# EAGLE design Business Card (EAGLE 6.4)
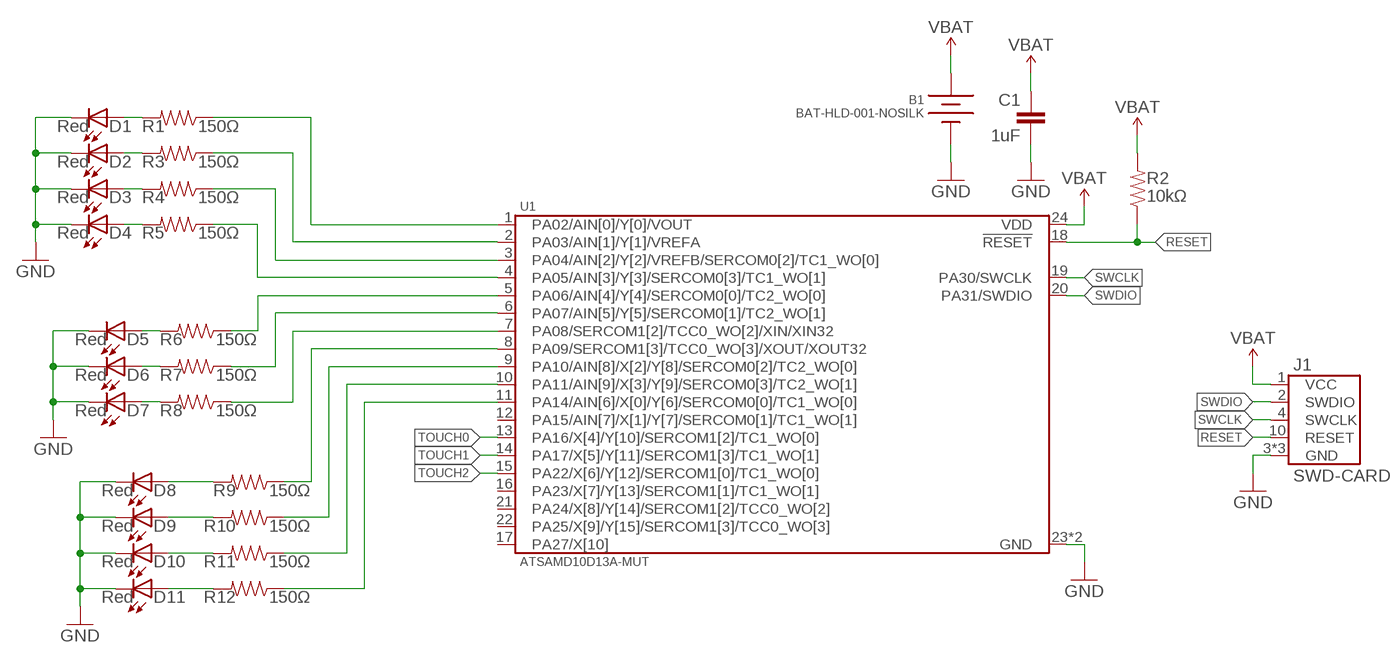
[diagram p0: schematic, sheet 1]

## Parts
B1  BAT-HLD-001-NOSILK  [BK-912-G-TR]
C1  1uF  CAP-0603  [0603-CAP]
D1  Red  LED-0805  [0805-LED]
D2  Red  LED-0805  [0805-LED]
D3  Red  LED-0805  [0805-LED]
D4  Red  LED-0805  [0805-LED]
D5  Red  LED-0805  [0805-LED]
D6  Red  LED-0805  [0805-LED]
D7  Red  LED-0805  [0805-LED]
D8  Red  LED-0805  [0805-LED]
D9  Red  LED-0805  [0805-LED]
D10  Red  LED-0805  [0805-LED]
D11  Red  LED-0805  [0805-LED]
J1  SWD-CARD  [CWR-170-10-0203]
R1  150Ω  RESISTOR-0603  [0603-CAP]
R2  10kΩ  RESISTOR-0603  [0603-CAP]
R3  150Ω  RESISTOR-0603  [0603-CAP]
R4  150Ω  RESISTOR-0603  [0603-CAP]
R5  150Ω  RESISTOR-0603  [0603-CAP]
R6  150Ω  RESISTOR-0603  [0603-CAP]
R7  150Ω  RESISTOR-0603  [0603-CAP]
R8  150Ω  RESISTOR-0603  [0603-CAP]
R9  150Ω  RESISTOR-0603  [0603-CAP]
R10  150Ω  RESISTOR-0603  [0603-CAP]
R11  150Ω  RESISTOR-0603  [0603-CAP]
R12  150Ω  RESISTOR-0603  [0603-CAP]
U1  ATSAMD10D13A-MUT  [QFN-24]

## Nets
GND: B1.-(N) C1.2 D1.C D2.C D3.C D4.C D5.C D6.C D7.C D8.C D9.C D10.C D11.C J1.3(GND) J1.5(GND) J1.9(GND) U1.23(GND) U1.P$1(GND)
N$4: D1.A R1.2
N$5: D5.A R6.2
N$6: D2.A R3.2
N$7: D6.A R7.2
N$8: D3.A R4.2
N$9: D7.A R8.2
N$10: D4.A R5.2
N$11: D8.A R9.2
N$12: D9.A R10.2
N$13: D10.A R11.2
N$14: D11.A R12.2
N$15: R5.1 U1.4(PA05/AIN[3]/Y[3]/SERCOM0[3]/TC1_WO[1])
N$16: R4.1 U1.3(PA04/AIN[2]/Y[2]/VREFB/SERCOM0[2]/TC1_WO[0])
N$17: R3.1 U1.2(PA03/AIN[1]/Y[1]/VREFA)
N$18: R1.1 U1.1(PA02/AIN[0]/Y[0]/VOUT)
N$19: R6.1 U1.5(PA06/AIN[4]/Y[4]/SERCOM0[0]/TC2_WO[0])
N$20: R7.1 U1.6(PA07/AIN[5]/Y[5]/SERCOM0[1]/TC2_WO[1])
N$21: R8.1 U1.7(PA08/SERCOM1[2]/TCC0_WO[2]/XIN/XIN32)
N$22: R9.1 U1.8(PA09/SERCOM1[3]/TCC0_WO[3]/XOUT/XOUT32)
N$23: R10.1 U1.9(PA10/AIN[8]/X[2]/Y[8]/SERCOM0[2]/TC2_WO[0])
N$24: R11.1 U1.10(PA11/AIN[9]/X[3]/Y[9]/SERCOM0[3]/TC2_WO[1])
N$25: R12.1 U1.11(PA14/AIN[6]/X[0]/Y[6]/SERCOM0[0]/TC1_WO[0])
RESET: J1.10(RESET) R2.1 U1.18(!RESET)
SWCLK: J1.4(SWCLK) U1.19(PA30/SWCLK)
SWDIO: J1.2(SWDIO) U1.20(PA31/SWDIO)
TOUCH0: U1.13(PA16/X[4]/Y[10]/SERCOM1[2]/TC1_WO[0])
TOUCH1: U1.14(PA17/X[5]/Y[11]/SERCOM1[3]/TC1_WO[1])
TOUCH2: U1.15(PA22/X[6]/Y[12]/SERCOM1[0]/TC1_WO[0])
VBAT: B1.+1(P) B1.+2(P) C1.1 J1.1(VCC) R2.2 U1.24(VDD)
Unconnected: U1.12(PA15/AIN[7]/X[1]/Y[7]/SERCOM0[1]/TC1_WO[1]) U1.16(PA23/X[7]/Y[13]/SERCOM1[1]/TC1_WO[1]) U1.17(PA27/X[10]) U1.21(PA24/X[8]/Y[14]/SERCOM1[2]/TCC0_WO[2]) U1.22(PA25/X[9]/Y[15]/SERCOM1[3]/TCC0_WO[3])

## Library data of the parts
B1 = Connectors:BAT-HLD-001
C1 = Passives:CAP
D1-D11 = Passives:LED
J1 = Connectors:SWD
R1-R12 = Passives:RESISTOR
U1 = Atmel:ATSAMD10D

## Board
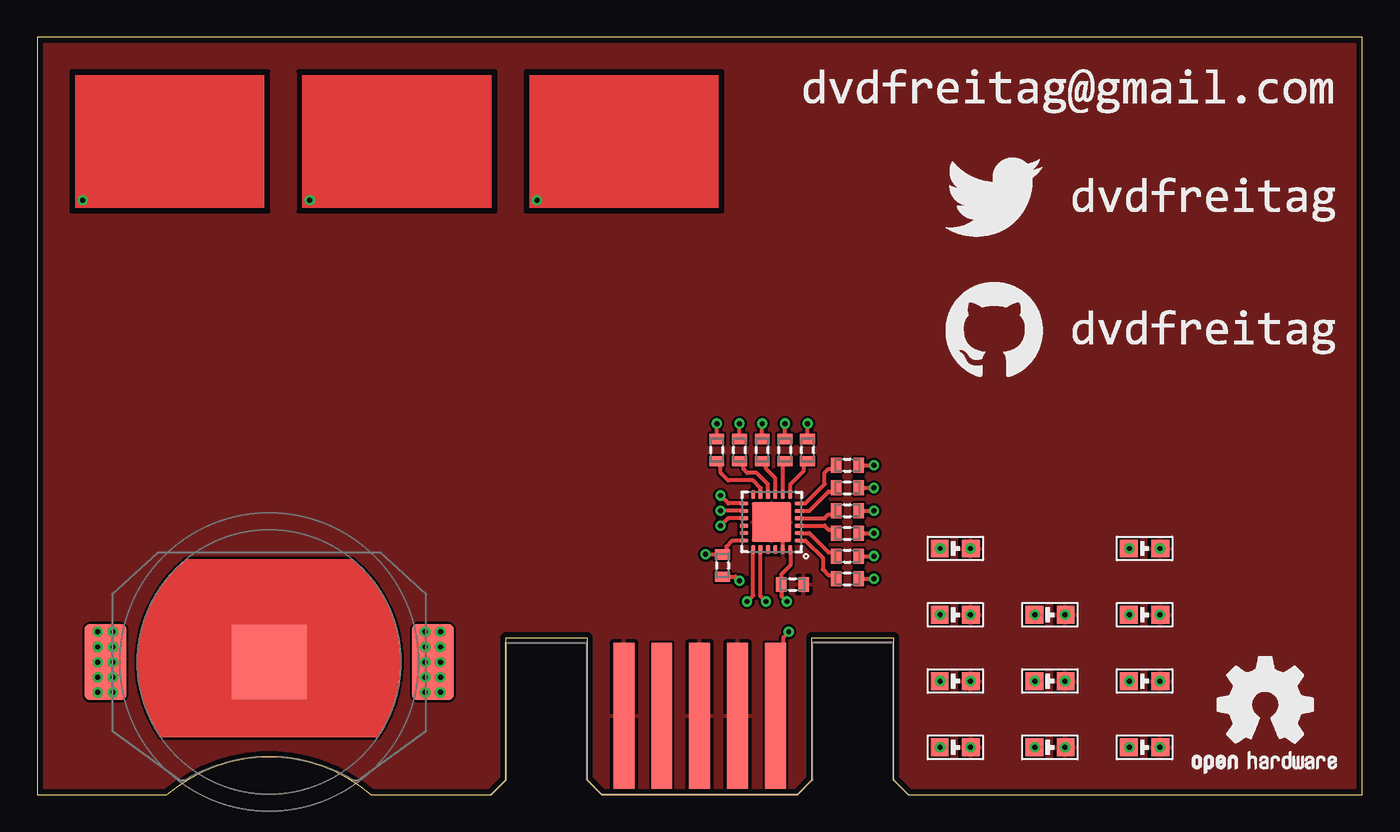
[diagram p1: board, top side]
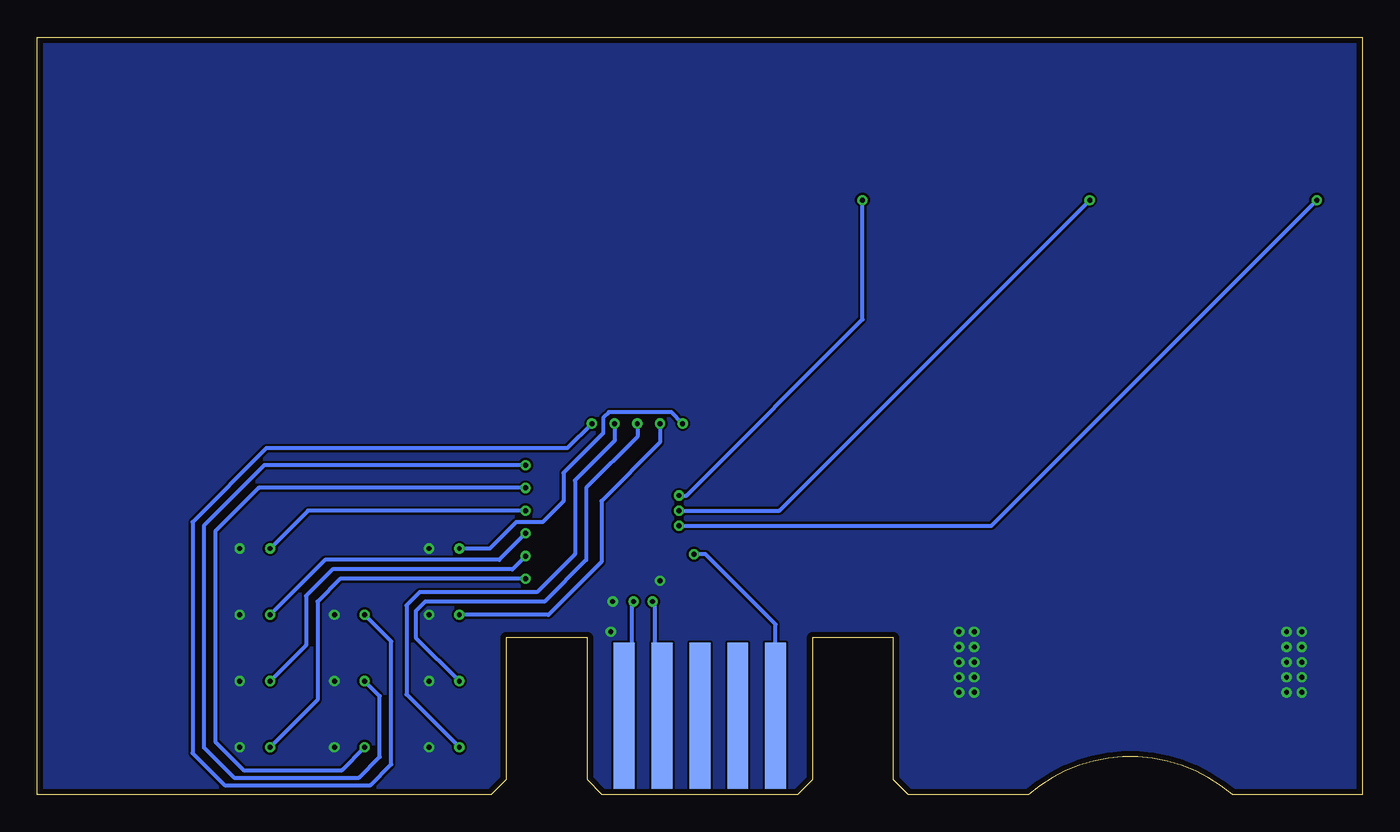
[diagram p2: board, bottom side, seen from below]

Size 88.9 x 50.8 mm. Coordinates in mm from the lower left corner, seen from the top.
Outline: 0,0 8.7,0 arc-81 22.42,0 30.45,0 31.45,1 31.45,10.52 36.9,10.52 36.9,1 37.9,0 50.99,0 51.99,1 51.99,10.52 57.45,10.52 57.45,1 58.45,0 88.9,0 88.9,50.8 0,50.8 0,0
Copper layers (1*16): Top 0.0356mm / dielectric 1.5011mm / Bottom 0.0356mm
Design rules "oshpark-2layer *": minimum track width 6mil, minimum drill 13mil, track to track 6mil, track to pad 6mil, pad to pad 6mil, via to via 6mil, smd to smd 6mil, copper to edge 15mil, drill to drill 6mil, minimum pad ring 7mil, minimum via ring 7mil, stop-mask expansion 4mil, vias tented up to drill 20mil, thermal gap 10mil
tRestrict: 12 lines

### Footprints (pad centres in the part's own frame; a part is rotated, then mirrored left to right if it is on the bottom)
BK-912-G-TR = smd 2.79 x 5.08: +1 -10.985,0; +2 10.985,0 | smd 5 x 5: - 0,0
0603-CAP = smd 0.7 x 1: 1 -0.75,0; 2 0.75,0
0805-LED = smd 1.2 x 1.2: A -1.05,0; C 1.05,0
CWR-170-10-0203 = smd 1.4 x 9.8: 1 -5.08,-5.3; 3 -2.54,-5.3; 5 0,-5.3; 7 2.54,-5.3; 9 5.08,-5.3 | smd 1.4 x 9.8 bottom: 2 -5.08,-5.3; 4 -2.54,-5.3; 6 0,-5.3; 8 2.54,-5.3; 10 5.08,-5.3
QFN-24 = smd 0.6 x 0.29: 1 -1.85,1.25; 2 -1.85,0.75; 3 -1.85,0.25; 4 -1.85,-0.25; 5 -1.85,-0.75; 6 -1.85,-1.25; 13 1.85,-1.25; 14 1.85,-0.75; 15 1.85,-0.25; 16 1.85,0.25; 17 1.85,0.75; 18 1.85,1.25 | smd 0.29 x 0.6: 7 -1.25,-1.85; 8 -0.75,-1.85; 9 -0.25,-1.85; 10 0.25,-1.85; 11 0.75,-1.85; 12 1.25,-1.85; 19 1.25,1.85; 20 0.75,1.85; 21 0.25,1.85; 22 -0.25,1.85; 23 -0.75,1.85; 24 -1.25,1.85 | smd 2.65 x 2.65: P$1 0,0

### Placement (x,y rotation side)
B1  15.56,8.89 0 top
C1  50.67,14.1 0 top
D1  74.3,3.17 0 top
D2  74.3,7.62 0 top
D3  74.3,12.06 0 top
D4  74.3,16.51 0 top
D5  67.94,3.17 0 top
D6  67.94,7.62 0 top
D7  67.94,12.06 0 top
D8  61.59,3.17 0 top
D9  61.59,7.62 0 top
D10  61.59,12.06 0 top
D11  61.59,16.51 0 top
J1  44.45,0 180 top
R1  54.36,14.48 0 top
R2  45.97,15.37 270 top
R3  54.36,16 0 top
R4  54.36,17.53 0 top
R5  54.36,19.05 0 top
R6  54.36,20.57 0 top
R7  54.36,22.1 0 top
R8  51.69,23.11 90 top
R9  50.16,23.11 90 top
R10  48.64,23.11 90 top
R11  47.12,23.11 90 top
R12  45.59,23.11 90 top
U1  49.28,18.29 180 top
U$1  [GITHUB]  60.96,27.94 0 top
U$2  [TWITTER]  60.96,36.83 0 top
U$3  [OSHW]  77.47,1.27 0 top
U$4  [EMAIL]  51.44,45.72 0 top

### Tracks (layer width: path | path; a pad name or v marks a point on that pad's centre or on a via)
GND
  Top 0.254: U1.23 50.03,17.54 U1.P$1
  pour Top (rank 2): -1.27,52.07 90.17,52.07 90.17,-1.27 -1.27,-1.27
N$4  (via drill 0.33)
  Top 0.254: D1.A v73.28,3.17 | R1.2 v56.13,14.48
  Bottom 0.254: v56.13,14.48 68.58,14.48 70.1,12.95 70.1,6.35 v73.28,3.17
N$5  (via drill 0.33)
  Top 0.254: D5.A v66.93,3.17 | R6.2 v56.13,20.57
  Bottom 0.254: v56.13,20.57 74.04,20.57 76.96,17.65 76.96,3.56 75.06,1.65 68.45,1.65 v66.93,3.17
N$6  (via drill 0.33)
  Top 0.254: D2.A v73.28,7.62 | R3.2 v56.13,16
  Bottom 0.254: v56.13,16 57.02,15.11 69.09,15.11 70.87,13.34 70.87,10.03 v73.28,7.62
N$7  (via drill 0.33)
  Top 0.254: D6.A v66.93,7.62 | R7.2 v56.13,22.1
  Bottom 0.254: v56.13,22.1 73.66,22.1 77.72,18.03 77.72,3.17 75.69,1.14 67.31,1.14 65.91,2.54 65.91,6.6 v66.93,7.62
N$8  (via drill 0.33)
  Top 0.254: D3.A v73.28,12.06 | R4.2 v56.13,17.53
  Bottom 0.254: v56.13,17.53 57.91,15.75 69.6,15.75 v73.28,12.06
N$9  (via drill 0.33)
  Top 0.254: D7.A v66.93,12.06 | R8.2 v51.69,24.89
  Bottom 0.254: v51.69,24.89 53.34,23.24 73.53,23.24 78.49,18.29 78.49,2.79 76.33,0.64 66.55,0.64 65.15,2.03 65.15,10.29 v66.93,12.06
N$10  (via drill 0.33)
  Top 0.254: D4.A v73.28,16.51 | R5.2 v56.13,19.05
  Bottom 0.254: v56.13,19.05 70.74,19.05 v73.28,16.51
N$11  (via drill 0.33)
  Top 0.254: D8.A v60.58,3.17 | R9.2 v50.16,24.89
  Bottom 0.254: v50.16,24.89 50.16,23.75 52.83,21.08 52.83,16.13 55.37,13.59 63.25,13.59 64.14,12.7 64.14,6.73 v60.58,3.17
N$12  (via drill 0.33)
  Top 0.254: D9.A v60.58,7.62 | R10.2 v48.64,24.89
  Bottom 0.254: v48.64,24.89 48.64,24 52.07,20.57 52.07,15.75 54.86,12.95 62.87,12.95 63.5,12.32 63.5,10.54 v60.58,7.62
N$13  (via drill 0.33)
  Top 0.254: D10.A v60.58,12.06 | R11.2 v47.12,24.89
  Bottom 0.254: v47.12,24.89 47.12,23.62 51.05,19.68 51.05,15.62 54.61,12.06 v60.58,12.06
N$14  (via drill 0.33)
  Top 0.254: D11.A v60.58,16.51 | R12.2 v45.59,24.89
  Bottom 0.254: v45.59,24.89 46.35,25.65 50.55,25.65 50.93,25.27 50.93,24.26 53.59,21.59 53.59,19.68 54.99,18.29 56.77,18.29 58.55,16.51 v60.58,16.51
N$15
  Top 0.254: U1.4 52.83,18.54 53.09,18.8 53.35,18.8 R5.1
N$16
  Top 0.254: U1.3 52.83,18.04 53.09,17.78 53.35,17.78 R4.1
N$17
  Top 0.254: U1.2 51.8,17.54 53.09,16.26 53.35,16.26 R3.1
N$18
  Top 0.254: U1.1 51.54,17.04 52.7,15.88 52.7,15.11 53.09,14.73 53.35,14.73 R1.1
N$19
  Top 0.254: U1.5 51.8,19.04 53.09,20.32 53.35,20.32 R6.1
N$20
  Top 0.254: U1.6 51.54,19.54 52.83,20.83 52.83,21.59 53.09,21.84 53.35,21.84 R7.1
N$21
  Top 0.254: U1.7 50.53,20.81 51.44,21.72 51.44,22.11 R8.1
N$22
  Top 0.254: U1.8 50.03,22.21 R9.1
N$23
  Top 0.254: U1.9 49.53,21.21 48.9,21.84 48.9,22.11 R10.1
N$24
  Top 0.254: U1.10 49.03,20.82 48.26,21.59 47.62,21.59 47.37,21.84 47.37,22.11 R11.1
N$25
  Top 0.254: U1.11 48.53,20.56 48.01,21.08 46.35,21.08 45.85,21.59 45.85,22.11 R12.1
RESET  (via drill 0.33)
  Top 0.254: 45.99,16.13 R2.1 | v44.83,16.13 R2.1 | U1.18 46.63,17.04 46.23,16.64 46.23,16.37 R2.1
  Bottom 0.254: J1.10 39.37,11.43 44.07,16.13 v44.83,16.13
SWCLK  (via drill 0.33)
  Top 0.254: v47.62,12.95 48.03,13.36 U1.19
  Bottom 0.254: J1.4 47.5,5.81 47.5,12.83 v47.62,12.95
SWDIO  (via drill 0.33)
  Top 0.254: v48.9,12.95 48.53,13.32 U1.20
  Bottom 0.254: J1.2 49.02,5.8 49.02,12.83 v48.9,12.95
TOUCH0  (via drill 0.33)
  Top 0.254: U1.13 46.38,19.54 v45.85,20.07
  Bottom 0.254: v45.85,20.07 45.34,20.07 33.53,31.88 v33.53,39.88
TOUCH1  (via drill 0.33)
  Top 0.254: U1.14 45.86,19.04 v45.85,19.05
  Bottom 0.254: v45.85,19.05 39.12,19.05 v18.29,39.88
TOUCH2  (via drill 0.33)
  Top 0.254: U1.15 46.35,18.54 v45.85,18.03
  Bottom 0.254: v45.85,18.03 24.89,18.03 v3.05,39.88
VBAT  (via drill 0.33)
  Top 0.254: B1.+1 v4.06,8.89 | B1.+2 v26.04,8.89 | R2.2 46.85,14.62 v47.12,14.35 | U1.24 50.53,15.39 49.92,14.78 C1.1 49.92,13.32 v50.29,12.95 | v50.42,10.92 50.04,10.54 50.04,9.65 J1.1
  other vias: 4.06,10.92 5.08,10.92 5.08,9.91 5.08,8.89 4.06,7.87 5.08,7.87 5.08,6.86 4.06,6.86 26.04,10.92 27.05,10.92 27.05,9.91 27.05,8.89 26.04,7.87 27.05,7.87 27.05,6.86 26.04,6.86 26.04,9.91 4.06,9.91 62.61,16.51 62.61,12.06 68.96,12.06 62.61,7.62 68.96,7.62 62.61,3.17 68.96,3.17 75.31,3.17 75.31,7.62 75.31,12.06 75.31,16.51
  pour Bottom (rank 2): -2.54,53.34 91.44,53.34 91.44,-2.54 -2.54,-2.54
(copper drawn outside any net)
  shapes: Top area x3